# Altium schematic sheet LT3461AES6#TRPBF.schdoc
size 54 x 32 mm
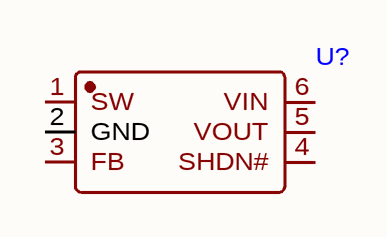
[diagram p0: LT3461AES6#TRPBF.schdoc]

## Parts
U?  (no value)  [TSOT-23-6_L2.9-W1.6-P0.95-LS2.8-BL]

## Nets

Not connected (* = marked no-connect by the designer): U? 1(SW) 2(GND) 3(FB) 4(SHDN#) 5(VOUT) 6(VIN)

## Library data of the parts
U? = LT3461AES6#TRPBF